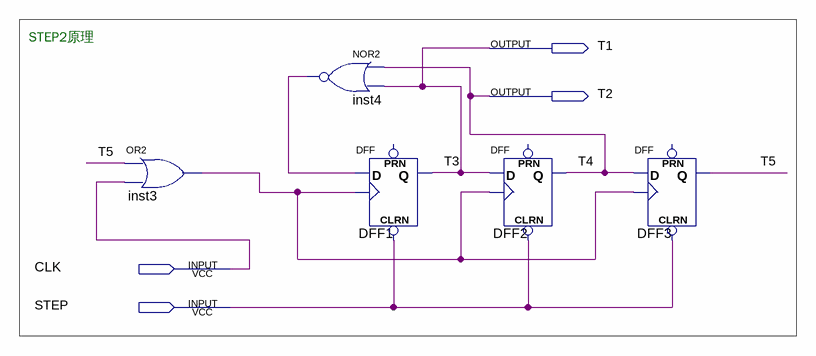
[diagram p0: schematic sheet]
// Quartus schematic STEP2.bdf as structural Verilog: 5 symbols, 4 pins
module STEP2 (
  input  CLK,
  input  STEP,
  output T1,
  output T2
);

  wire inst3_out, inst4_out, T5;

  or inst3 (inst3_out, T5, CLK);
  nor inst4 (inst4_out, T2, T1);
  DFF DFF1 (.CLRN(STEP), .CLK(inst3_out), .D(inst4_out), .Q(T1));  // open: PRN
  DFF DFF2 (.CLRN(STEP), .CLK(inst3_out), .D(T1), .Q(T2));  // open: PRN
  DFF DFF3 (.CLRN(STEP), .CLK(inst3_out), .D(T2), .Q(T5));  // open: PRN

  // Other names for the same wires on the sheet: T4 = T2; T3 = T1

  // Notes on the sheet:
  //   STEP2原理
endmodule
